# EAGLE schematic ESP8266 (EAGLE 7.7.0)
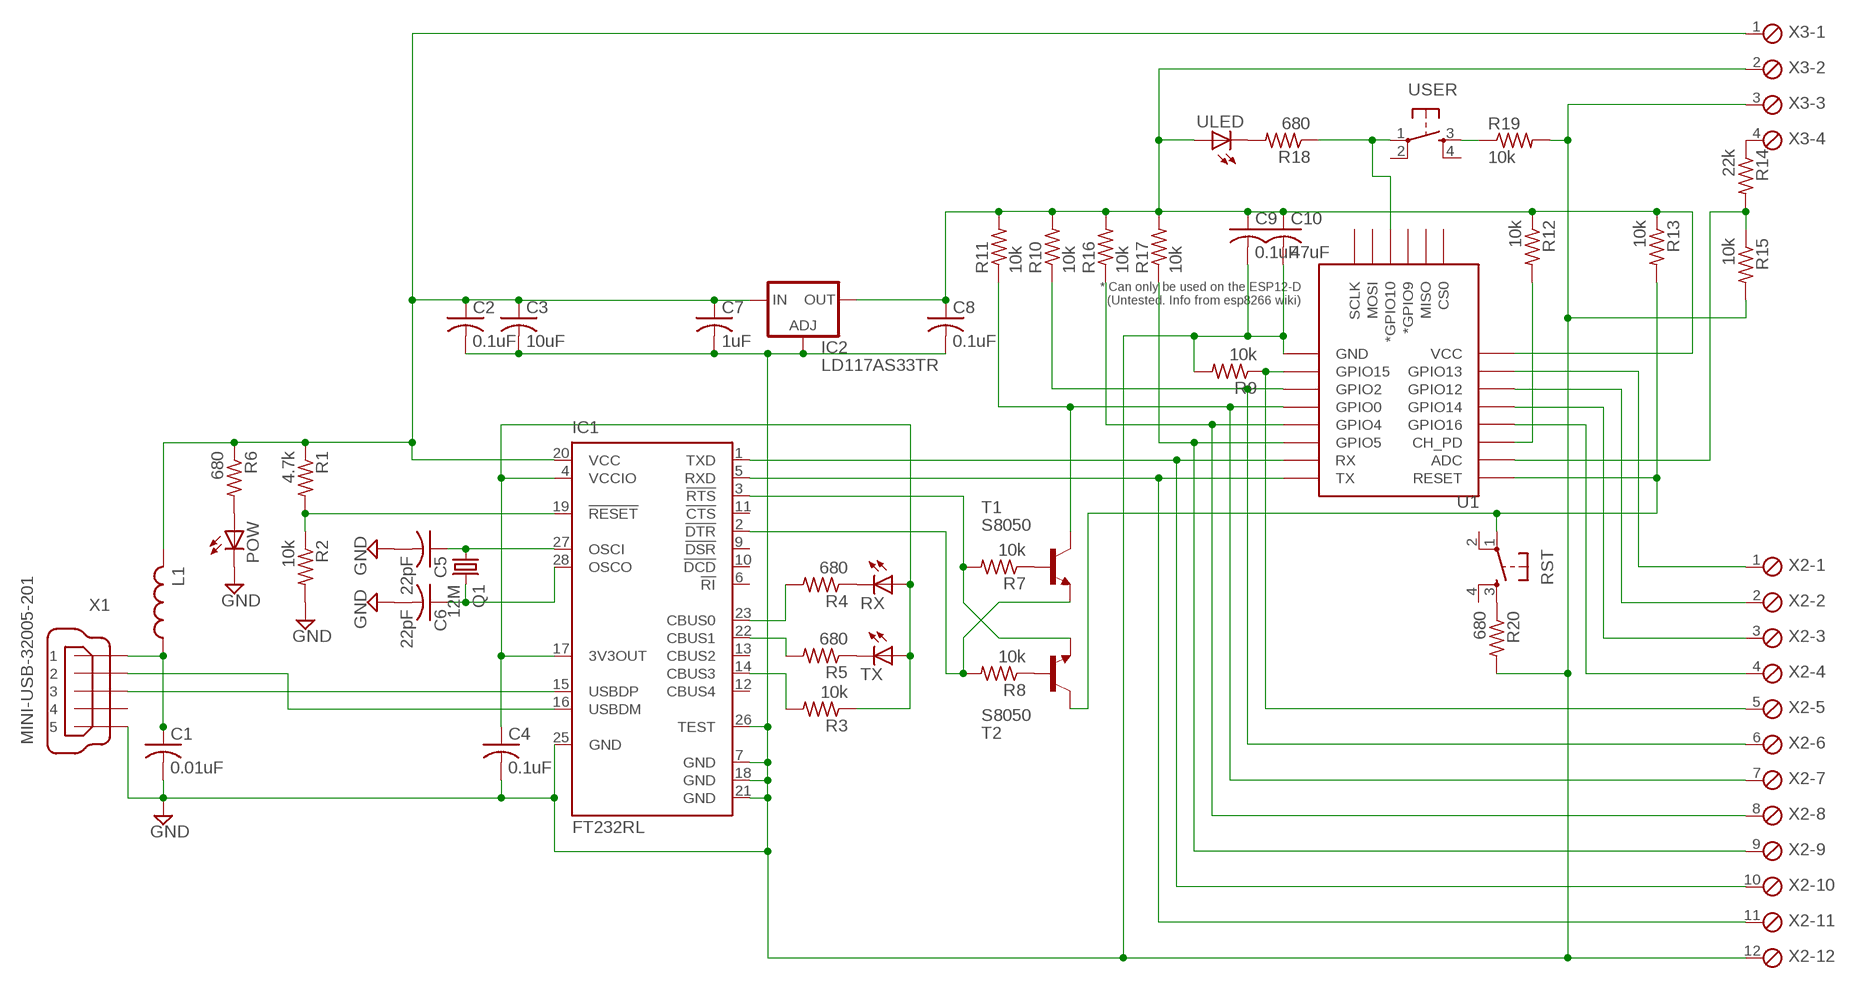
[diagram p0: schematic, sheet 1]

## Parts
C1  0.01uF  C-USC0805  [C0805]
C2  0.1uF  C-USC0805  [C0805]
C3  10uF  C-USC0805  [C0805]
C4  0.1uF  C-USC0805  [C0805]
C5  22pF  C-USC0805  [C0805]
C6  22pF  C-USC0805  [C0805]
C7  1uF  C-USC0805  [C0805]
C8  0.1uF  C-USC0805  [C0805]
C9  0.1uF  C-USC0805  [C0805]
C10  47uF  C-USC0805  [C0805]
IC1  FT232RL  [SSOP28]
IC2  LD117AS33TR  [SOT223]
L1  L-USL2012C  [L2012C]
POW  LEDCHIP-LED0805  [CHIP-LED0805]
Q1  12M  CRYSTALSM49  [SM49]
R1  4.7k  R-US_R0805  [R0805]
R2  10k  R-US_R0805  [R0805]
R3  10k  R-US_R0805  [R0805]
R4  680  R-US_R0805  [R0805]
R5  680  R-US_R0805  [R0805]
R6  680  R-US_R0805  [R0805]
R7  10k  R-US_R0805  [R0805]
R8  10k  R-US_R0805  [R0805]
R9  10k  R-US_R0805  [R0805]
R10  10k  R-US_R0805  [R0805]
R11  10k  R-US_R0805  [R0805]
R12  10k  R-US_R0805  [R0805]
R13  10k  R-US_R0805  [R0805]
R14  22k  R-US_R0805  [R0805]
R15  10k  R-US_R0805  [R0805]
R16  10k  R-US_R0805  [R0805]
R17  10k  R-US_R0805  [R0805]
R18  680  R-US_R0805  [R0805]
R19  10k  R-US_R0805  [R0805]
R20  680  R-US_R0805  [R0805]
RST  DTSM-6  [DTSM-6]
RX  LEDCHIP-LED0805  [CHIP-LED0805]
T1  S8050  -NPN-SOT23-EBC  [SOT23-EBC]
T2  S8050  -NPN-SOT23-EBC  [SOT23-EBC]
TX  LEDCHIP-LED0805  [CHIP-LED0805]
U1  ESP12ESMD  [ESP12E-SMD]
ULED  LEDCHIP-LED0805  [CHIP-LED0805]
USER  DTSM-6  [DTSM-6]
X1  MINI-USB-32005-201  [32005-201]
X2  MPT12  [12POL254]
X3  MPT4  [4POL254]

## Nets
GND: C1.2 C2.2 C3.2 C4.2 C5.2 C6.2 C7.2 C8.2 C9.2 C10.2 IC1.7(GND) IC1.18(GND) IC1.21(GND) IC1.25(GND) IC1.26(TEST) IC2.1(ADJ) POW.C R2.2 R9.2 R15.2 R19.2 R20.2 U1.GND X1.5 X2.12 X3.3
N$1: POW.A R6.2
N$2: IC1.15(USBDP) X1.3
N$3: IC1.16(USBDM) X1.2
N$4: C5.1 IC1.27(OSCI) Q1.1
N$5: C6.1 IC1.28(OSCO) Q1.2
N$6: IC1.19(!RESET) R1.2 R2.1
N$8: IC1.14(CBUS3) R3.2
N$9: IC1.22(CBUS1) R5.2
N$10: IC1.23(CBUS0) R4.2
N$11: R4.1 RX.C
N$12: R5.1 TX.C
N$13: IC1.1(TXD) U1.RXD0(RX) X2.10
N$14: IC1.5(RXD) U1.TXD0(TX) X2.11
N$15: R7.1 T1.B
N$16: R8.1 T2.B
N$17: IC1.3(!RTS) R7.2 T2.E
N$18: IC1.2(!DTR) R8.2 T1.E
N$19: R10.1 U1.GPIO2 X2.6
N$20: R9.1 U1.GPIO15 X2.5
N$21: R16.1 U1.GPIO4 X2.8
N$22: R12.2 U1.CH_PD
N$23: R13.2 RST.1 T2.C U1.RESET
N$24: C4.1 IC1.4(VCCIO) IC1.17(3V3OUT) R3.1 RX.A TX.A
N$25: R14.2 R15.1 U1.ADC
N$28: R17.1 U1.GPIO5 X2.9
N$29: R11.1 T1.C U1.GPIO0 X2.7
N$30: R18.2 ULED.C
N$31: R18.1 U1.GPIO10(*GPIO10) USER.1
N$32: R19.1 USER.3
N$33: R14.1 X3.4
N$34: R20.1 RST.3
N$37: U1.GPIO13 X2.1
N$38: U1.GPIO12 X2.2
N$39: U1.GPIO14 X2.3
N$40: U1.GPIO16 X2.4
V33E: C8.1 C9.1 C10.1 IC2.4(OUT) R10.2 R11.2 R12.1 R13.1 R16.2 R17.2 U1.VCC ULED.A X3.2
VBUS: C1.1 L1.1 X1.1
VCC: C2.1 C3.1 C7.1 IC1.20(VCC) IC2.3(IN) L1.2 R1.1 R6.1 X3.1
Unconnected: IC1.6(!RI) IC1.9(!DSR) IC1.10(!DCD) IC1.11(!CTS) IC1.12(CBUS4) IC1.13(CBUS2) RST.2 RST.4 U1.CS0 U1.GPIO9(*GPIO9) U1.MISO U1.MOSI U1.SCLK USER.2 USER.4 X1.4

## Library data of the parts
C1-C10 = rcl:C-US: CAPACITOR, American symbol
IC1 = ftdichip:FT232R: Source: http://www.ftdichip.com/Documents/DataSheets/DS_FT232R_v104.pdf; MPN: FT232RL; OC_FARNELL: 1146032; OC_NEWARK: 91K9918
IC2 = v-reg:LD117A?*: Low drop fixed and adjustable positive voltage regulators 1 A Source: http://www.st.com/stonline/products/literature/ds/7194/ld1117axx.pdf
L1 = rcl:L-US: INDUCTOR, American symbol
POW RX TX ULED = led:LED: LED OSRAM: - CHIPLED LG R971, LG N971, LY N971, LG Q971, LY Q971, LO R971, LY R971 LH N974, LH R974 LS Q976, LO Q976, LY Q976 LO Q996 - Hyper CHIPLED LW Q18S LB Q993, LB Q99A, LB R99A - SideLED LS A670, LO A670, LY A670, LG A670, LP A670 LB A673, LV A673, LT A673, LW A673 LH A674 LY A675 LS A676, LA A676, LO A676, LY A676, LW A676 LS A679, LY A679, LG A679 - Hyper Micro SIDELED® LS Y876, LA Y876, LO Y876, LY Y876 LT Y87S - SmartLED LW L88C, LW L88S LB L89C, LB L89S, LG L890 LS L89K, LO L89K, LY L89K LS L896, LA L896, LO L896, LY L896 - TOPLED LS T670, LO T670, LY T670, LG T670, LP T670 LSG T670, LSP T670, LSY T670, LOP T670, LYG T670 LG T671, LOG T671, LSG T671 LB T673, LV T673, LT T673, LW T673 LH T674 LS T676, LA T676, LO T676, LY T676, LB T676, LH T676, LSB T676, LW T676 LB T67C, LV T67C, LT T67C, LS T67K, LO T67K, LY T67K, LW E67C LS E67B, LA E67B, LO E67B, LY E67B, LB E67C, LV E67C, LT E67C LW T67C LS T679, LY T679, LG T679 LS T770, LO T770, LY T770, LG T770, LP T770 LB T773, LV T773, LT T773, LW T773 LH T774 LS E675, LA E675, LY E675, LS T675 LS T776, LA T776, LO T776, LY T776, LB T776 LHGB T686 LT T68C, LB T68C - Hyper Mini TOPLED® LB M676 - Mini TOPLED Santana® LG M470 LS M47K, LO M47K, LY M47K Source: http://www.osram.convergy.de LUXEON: - LUMILED® LXK2-PW12-R00, LXK2-PW12-S00, LXK2-PW14-U00, LXK2-PW14-V00 LXK2-PM12-R00, LXK2-PM12-S00, LXK2-PM14-U00 LXK2-PE12-Q00, LXK2-PE12-R00, LXK2-PE12-S00, LXK2-PE14-T00, LXK2-PE14-U00 LXK2-PB12-K00, LXK2-PB12-L00, LXK2-PB12-M00, LXK2-PB14-N00, LXK2-PB14-P00, LXK2-PB14-Q00 LXK2-PR12-L00, LXK2-PR12-M00, LXK2-PR14-Q00, LXK2-PR14-R00 LXK2-PD12-Q00, LXK2-PD12-R00, LXK2-PD12-S00 LXK2-PH12-R00, LXK2-PH12-S00 LXK2-PL12-P00, LXK2-PL12-Q00, LXK2-PL12-R00 Source: www.luxeon.com KINGBRIGHT: KA-3528ASYC Source: www.kingbright.com
Q1 = crystal:CRYSTAL: CRYSTAL; OC_FARNELL: unknown; OC_NEWARK: unknown
R1-R20 = rcl:R-US_: RESISTOR, American symbol
RST USER = switch-tact:DTSM-6
T1 T2 = transistor:*-NPN-: NPN Transistror BF959 corrected 2008.03.06
U1 = esp8266modules:ESP12E: ESP12E Module
X1 = con-cypressindustries:MINI-USB-: MINI USB-B Conector Source: www.cypressindustries.com; OC_FARNELL: unknown; OC_NEWARK: unknown
X2 = con-phoenix-254:MPT12: PHOENIX CONNECTOR; OC_FARNELL: unknown; OC_NEWARK: unknown
X3 = con-phoenix-254:MPT4: PHOENIX CONNECTOR; OC_FARNELL: unknown; OC_NEWARK: unknown